# EasyEDA schematic EASYEDA.json
TITLE: Travichora (or whatever we're calling it now); REV: 2.0; Date: 2020-11-23; Sheet: 1/1; Drawn By: Liam
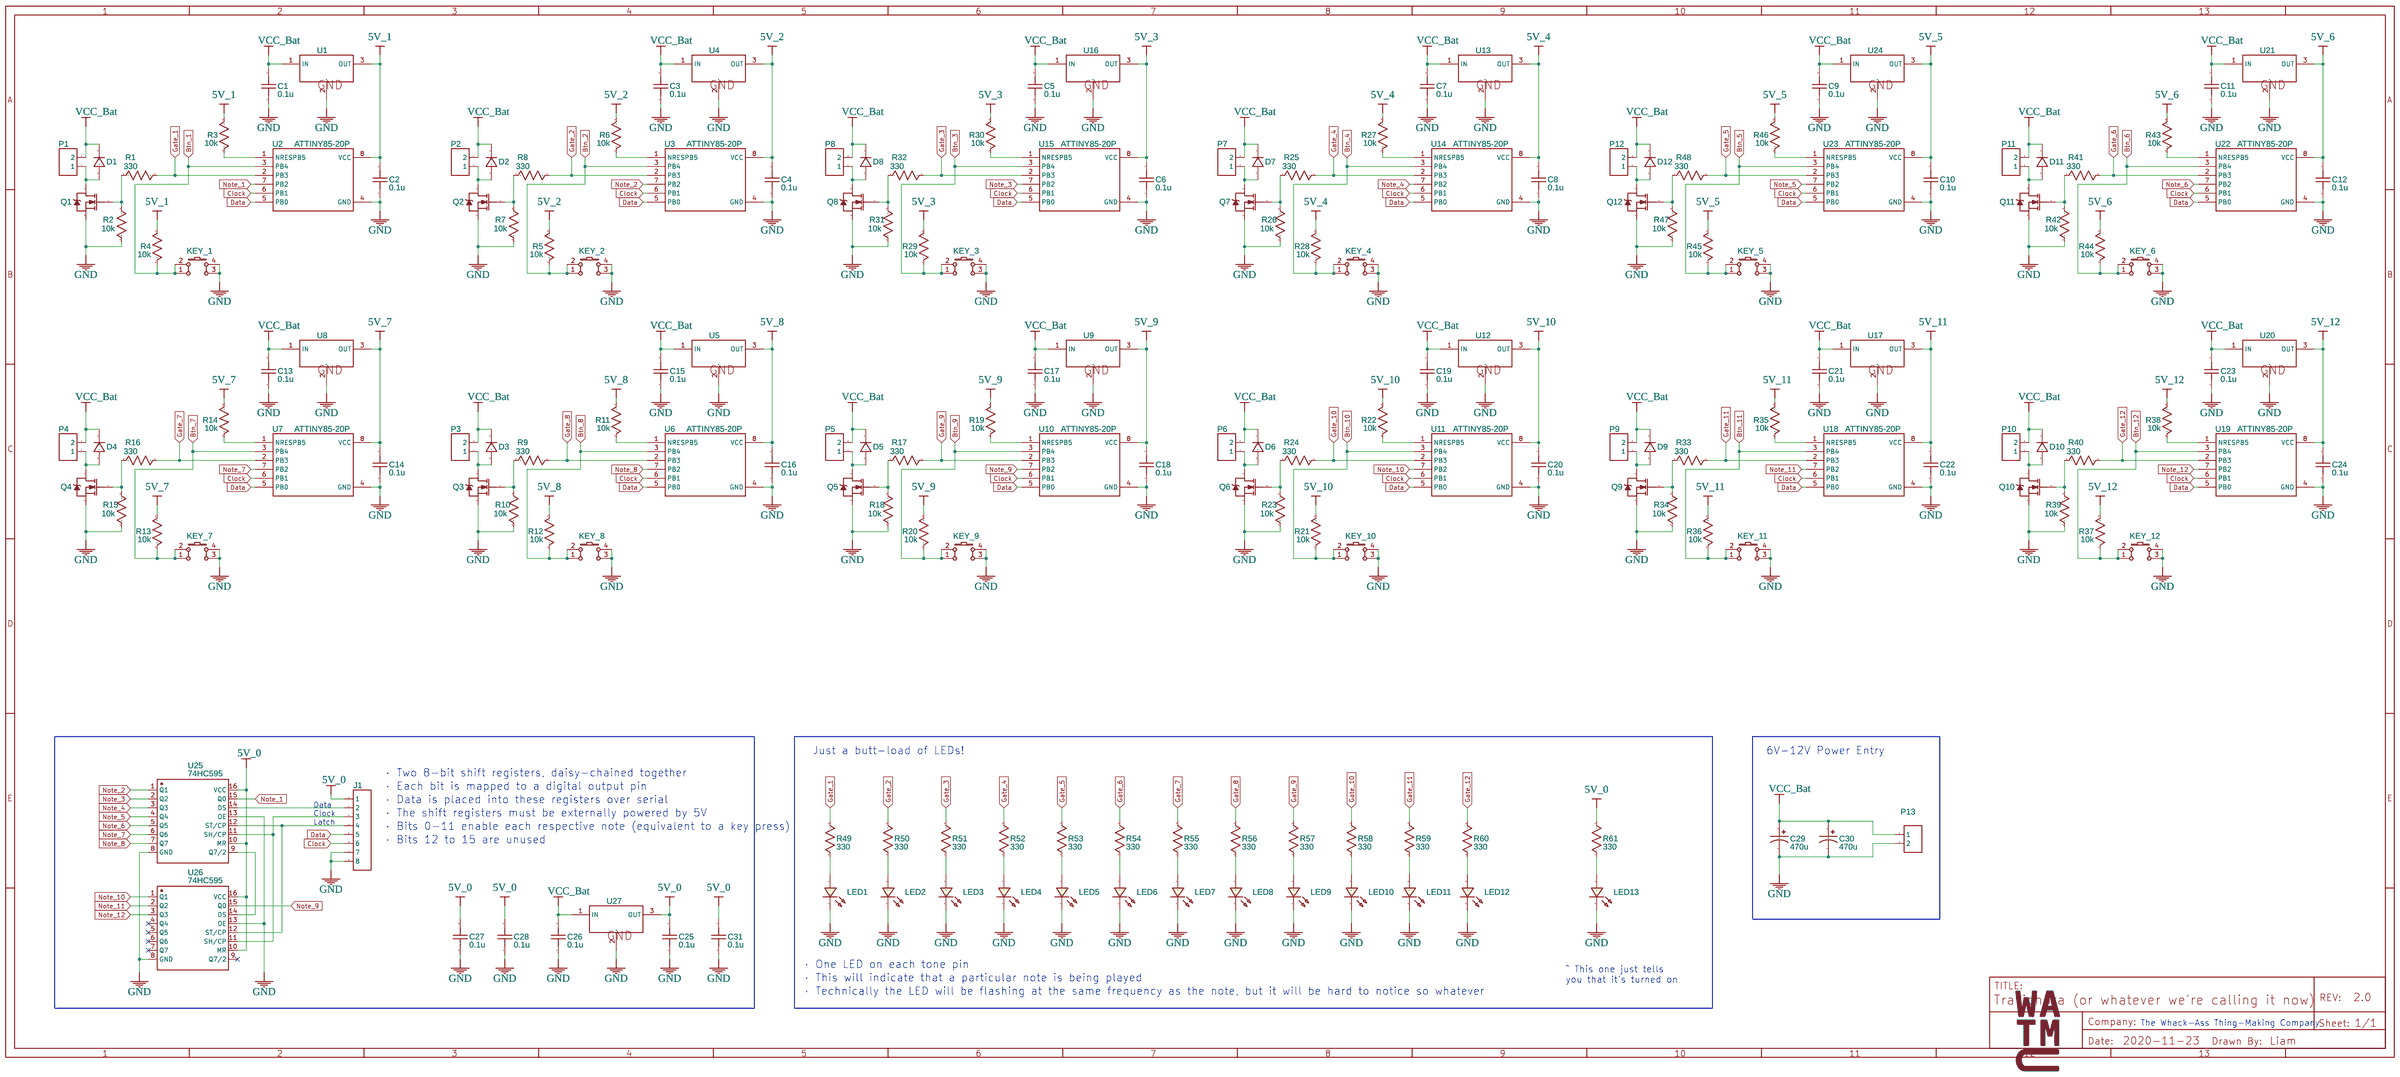
[diagram p0: schematic sheet]

## Parts
C1  0.1u  [C1206]
C2  0.1u  [C1206]
C3  0.1u  [C1206]
C4  0.1u  [C1206]
C5  0.1u  [C1206]
C6  0.1u  [C1206]
C7  0.1u  [C1206]
C8  0.1u  [C1206]
C9  0.1u  [C1206]
C10  0.1u  [C1206]
C11  0.1u  [C1206]
C12  0.1u  [C1206]
C13  0.1u  [C1206]
C14  0.1u  [C1206]
C15  0.1u  [C1206]
C16  0.1u  [C1206]
C17  0.1u  [C1206]
C18  0.1u  [C1206]
C19  0.1u  [C1206]
C20  0.1u  [C1206]
C21  0.1u  [C1206]
C22  0.1u  [C1206]
C23  0.1u  [C1206]
C24  0.1u  [C1206]
C25  0.1u  [C1206]
C26  0.1u  [C1206]
C27  0.1u  [C1206]
C28  0.1u  [C1206]
C29  470u  [CAP-D10.0×F5.0]
C30  470u  [CAP-D10.0×F5.0]
C31  0.1u  [C1206]
D1  1N4007  [DO-41_BD2.4-L4.7-P8.70-D0.9-RD]
D2  1N4007  [DO-41_BD2.4-L4.7-P8.70-D0.9-RD]
D3  1N4007  [DO-41_BD2.4-L4.7-P8.70-D0.9-RD]
D4  1N4007  [DO-41_BD2.4-L4.7-P8.70-D0.9-RD]
D5  1N4007  [DO-41_BD2.4-L4.7-P8.70-D0.9-RD]
D6  1N4007  [DO-41_BD2.4-L4.7-P8.70-D0.9-RD]
D7  1N4007  [DO-41_BD2.4-L4.7-P8.70-D0.9-RD]
D8  1N4007  [DO-41_BD2.4-L4.7-P8.70-D0.9-RD]
D9  1N4007  [DO-41_BD2.4-L4.7-P8.70-D0.9-RD]
D10  1N4007  [DO-41_BD2.4-L4.7-P8.70-D0.9-RD]
D11  1N4007  [DO-41_BD2.4-L4.7-P8.70-D0.9-RD]
D12  1N4007  [DO-41_BD2.4-L4.7-P8.70-D0.9-RD]
J1  HDR-M-2.54_1x8  [HDR-M-2.54_1X8]
KEY_1  K4-6×6_TH  [KEY-TH_4P-L6.0-W6.0-P4.50-LS6.5]
KEY_2  K4-6×6_TH  [KEY-TH_4P-L6.0-W6.0-P4.50-LS6.5]
KEY_3  K4-6×6_TH  [KEY-TH_4P-L6.0-W6.0-P4.50-LS6.5]
KEY_4  K4-6×6_TH  [KEY-TH_4P-L6.0-W6.0-P4.50-LS6.5]
KEY_5  K4-6×6_TH  [KEY-TH_4P-L6.0-W6.0-P4.50-LS6.5]
KEY_6  K4-6×6_TH  [KEY-TH_4P-L6.0-W6.0-P4.50-LS6.5]
KEY_7  K4-6×6_TH  [KEY-TH_4P-L6.0-W6.0-P4.50-LS6.5]
KEY_8  K4-6×6_TH  [KEY-TH_4P-L6.0-W6.0-P4.50-LS6.5]
KEY_9  K4-6×6_TH  [KEY-TH_4P-L6.0-W6.0-P4.50-LS6.5]
KEY_10  K4-6×6_TH  [KEY-TH_4P-L6.0-W6.0-P4.50-LS6.5]
KEY_11  K4-6×6_TH  [KEY-TH_4P-L6.0-W6.0-P4.50-LS6.5]
KEY_12  K4-6×6_TH  [KEY-TH_4P-L6.0-W6.0-P4.50-LS6.5]
LED1  LED-TH-3mm_R  [LED-TH_BD3.0_RED]
LED2  LED-TH-3mm_R  [LED-TH_BD3.0_RED]
LED3  LED-TH-3mm_R  [LED-TH_BD3.0_RED]
LED4  LED-TH-3mm_R  [LED-TH_BD3.0_RED]
LED5  LED-TH-3mm_R  [LED-TH_BD3.0_RED]
LED6  LED-TH-3mm_R  [LED-TH_BD3.0_RED]
LED7  LED-TH-3mm_R  [LED-TH_BD3.0_RED]
LED8  LED-TH-3mm_R  [LED-TH_BD3.0_RED]
LED9  LED-TH-3mm_R  [LED-TH_BD3.0_RED]
LED10  LED-TH-3mm_R  [LED-TH_BD3.0_RED]
LED11  LED-TH-3mm_R  [LED-TH_BD3.0_RED]
LED12  LED-TH-3mm_R  [LED-TH_BD3.0_RED]
LED13  LED-TH-3mm_G  [LED-TH_BD3.0_GREEN]
P1  Magnet 1  [CONN-TH_2P-P5.00]
P2  Magnet 1  [CONN-TH_2P-P5.00]
P3  Magnet 1  [CONN-TH_2P-P5.00]
P4  Magnet 1  [CONN-TH_2P-P5.00]
P5  Magnet 1  [CONN-TH_2P-P5.00]
P6  Magnet 1  [CONN-TH_2P-P5.00]
P7  Magnet 1  [CONN-TH_2P-P5.00]
P8  Magnet 1  [CONN-TH_2P-P5.00]
P9  Magnet 1  [CONN-TH_2P-P5.00]
P10  Magnet 1  [CONN-TH_2P-P5.00]
P11  Magnet 1  [CONN-TH_2P-P5.00]
P12  Magnet 1  [CONN-TH_2P-P5.00]
P13  Magnet 1  [CONN-TH_2P-P5.00]
Q1  30N06L-TA3-T  [TO-220-3_L10.0-W4.5-P2.54-T]
Q2  30N06L-TA3-T  [TO-220-3_L10.0-W4.5-P2.54-T]
Q3  30N06L-TA3-T  [TO-220-3_L10.0-W4.5-P2.54-T]
Q4  30N06L-TA3-T  [TO-220-3_L10.0-W4.5-P2.54-T]
Q5  30N06L-TA3-T  [TO-220-3_L10.0-W4.5-P2.54-T]
Q6  30N06L-TA3-T  [TO-220-3_L10.0-W4.5-P2.54-T]
Q7  30N06L-TA3-T  [TO-220-3_L10.0-W4.5-P2.54-T]
Q8  30N06L-TA3-T  [TO-220-3_L10.0-W4.5-P2.54-T]
Q9  30N06L-TA3-T  [TO-220-3_L10.0-W4.5-P2.54-T]
Q10  30N06L-TA3-T  [TO-220-3_L10.0-W4.5-P2.54-T]
Q11  30N06L-TA3-T  [TO-220-3_L10.0-W4.5-P2.54-T]
Q12  30N06L-TA3-T  [TO-220-3_L10.0-W4.5-P2.54-T]
R1  330  [R1206]
R2  10k  [R1206]
R3  10k  [R1206]
R4  10k  [R1206]
R5  10k  [R1206]
R6  10k  [R1206]
R7  10k  [R1206]
R8  330  [R1206]
R9  330  [R1206]
R10  10k  [R1206]
R11  10k  [R1206]
R12  10k  [R1206]
R13  10k  [R1206]
R14  10k  [R1206]
R15  10k  [R1206]
R16  330  [R1206]
R17  330  [R1206]
R18  10k  [R1206]
R19  10k  [R1206]
R20  10k  [R1206]
R21  10k  [R1206]
R22  10k  [R1206]
R23  10k  [R1206]
R24  330  [R1206]
R25  330  [R1206]
R26  10k  [R1206]
R27  10k  [R1206]
R28  10k  [R1206]
R29  10k  [R1206]
R30  10k  [R1206]
R31  10k  [R1206]
R32  330  [R1206]
R33  330  [R1206]
R34  10k  [R1206]
R35  10k  [R1206]
R36  10k  [R1206]
R37  10k  [R1206]
R38  10k  [R1206]
R39  10k  [R1206]
R40  330  [R1206]
R41  330  [R1206]
R42  10k  [R1206]
R43  10k  [R1206]
R44  10k  [R1206]
R45  10k  [R1206]
R46  10k  [R1206]
R47  10k  [R1206]
R48  330  [R1206]
R49  330  [R1206]
R50  330  [R1206]
R51  330  [R1206]
R52  330  [R1206]
R53  330  [R1206]
R54  330  [R1206]
R55  330  [R1206]
R56  330  [R1206]
R57  330  [R1206]
R58  330  [R1206]
R59  330  [R1206]
R60  330  [R1206]
R61  330  [R1206]
U1  7805(TO-220)  [TO-220-3_L10.0-W4.5-P2.54-L]
U2  ATTINY85-20P  [PDIP8]
U3  ATTINY85-20P  [PDIP8]
U4  7805(TO-220)  [TO-220-3_L10.0-W4.5-P2.54-L]
U5  7805(TO-220)  [TO-220-3_L10.0-W4.5-P2.54-L]
U6  ATTINY85-20P  [PDIP8]
U7  ATTINY85-20P  [PDIP8]
U8  7805(TO-220)  [TO-220-3_L10.0-W4.5-P2.54-L]
U9  7805(TO-220)  [TO-220-3_L10.0-W4.5-P2.54-L]
U10  ATTINY85-20P  [PDIP8]
U11  ATTINY85-20P  [PDIP8]
U12  7805(TO-220)  [TO-220-3_L10.0-W4.5-P2.54-L]
U13  7805(TO-220)  [TO-220-3_L10.0-W4.5-P2.54-L]
U14  ATTINY85-20P  [PDIP8]
U15  ATTINY85-20P  [PDIP8]
U16  7805(TO-220)  [TO-220-3_L10.0-W4.5-P2.54-L]
U17  7805(TO-220)  [TO-220-3_L10.0-W4.5-P2.54-L]
U18  ATTINY85-20P  [PDIP8]
U19  ATTINY85-20P  [PDIP8]
U20  7805(TO-220)  [TO-220-3_L10.0-W4.5-P2.54-L]
U21  7805(TO-220)  [TO-220-3_L10.0-W4.5-P2.54-L]
U22  ATTINY85-20P  [PDIP8]
U23  ATTINY85-20P  [PDIP8]
U24  7805(TO-220)  [TO-220-3_L10.0-W4.5-P2.54-L]
U25  74HC595  [DIP16]
U26  74HC595  [DIP16]
U27  7805(TO-220)  [TO-220-3_L10.0-W4.5-P2.54-L]

## Library data of the parts
C1-C28 C31 = C_1206_US: Contributor: LCEDA_Lib
C29 C30 = CE_TH_D10.0×F5.0_US: Contributor: LCEDA_Lib
D1-D12 = 1N4007: Supplier: LCSC; Manufacturer: SEMTECH; Supplier Part: C106903; Contributor: LCEDA_Lib
J1 = HDR-M-2.54_1x8: Supplier Part: C190820; Supplier: LCSC; Contributor: LCEDA_Lib
KEY_1-KEY_12 = K4-6×6_TH: Supplier: LCSC; Supplier Part: C136684; Manufacturer: 韩国韩荣; Manufacturer Part: K2-1102DP-E4SW-04; Contributor: LCEDA_Lib
LED1-LED12 = LED-TH-3mm_R: Manufacturer: EVERLIGHT(台湾亿光); Manufacturer Part: 204-10SDRD/S530-A3-L; Supplier Part: C84774; Supplier: LCSC; Contributor: LCEDA_Lib
LED13 = LED-TH-3mm_G: Manufacturer: EVERLIGHT(台湾亿光); Manufacturer Part: 204-10SYGD/S530-E3; Supplier Part: C85161; Contributor: LCEDA_Lib
P1-P13 = CONN-TH_2P-P5.00: Supplier: LCSC; Contributor: LCEDA_Lib
Q1-Q12 = 30N06L-TA3-T: Supplier: LCSC; Manufacturer: UTC; Supplier Part: C99961
R1-R61 = R_AXIAL-0.3_US: Contributor: LCEDA_Lib
U1 U4 U5 U8 U9 U12 U13 U16 U17 U20 U21 U24 U27 = 7805(TO-220): Supplier: LCSC; Manufacturer: STMicroelectronics; Manufacturer Part: L7805CV-DG; Supplier Part: C3795; Contributor: LCEDA_Lib
U2 U3 U6 U7 U10 U11 U14 U15 U18 U19 U22 U23 = ATTINY85-20P
U25 U26 = 74HC595N,112

## Nets
5V_0: C25.2 C27.2 C28.2 C31.2 J1.1 R61.2 U25.10(MR) U25.16(VCC) U26.10(MR) U26.16(VCC) U27.3(OUT)
5V_1: C2.2 R3.2 R4.2 U1.3(OUT) U2.8(VCC)
5V_2: C4.2 R5.2 R6.2 U3.8(VCC) U4.3(OUT)
5V_3: C6.2 R29.2 R30.2 U15.8(VCC) U16.3(OUT)
5V_4: C8.2 R27.2 R28.2 U13.3(OUT) U14.8(VCC)
5V_5: C10.2 R45.2 R46.2 U23.8(VCC) U24.3(OUT)
5V_6: C12.2 R43.2 R44.2 U21.3(OUT) U22.8(VCC)
5V_7: C14.2 R13.2 R14.2 U7.8(VCC) U8.3(OUT)
5V_8: C16.2 R11.2 R12.2 U5.3(OUT) U6.8(VCC)
5V_9: C18.2 R19.2 R20.2 U9.3(OUT) U10.8(VCC)
5V_10: C20.2 R21.2 R22.2 U11.8(VCC) U12.3(OUT)
5V_11: C22.2 R35.2 R36.2 U17.3(OUT) U18.8(VCC)
5V_12: C24.2 R37.2 R38.2 U19.8(VCC) U20.3(OUT)
GND: C1.1 C2.1 C3.1 C4.1 C5.1 C6.1 C7.1 C8.1 C9.1 C10.1 C11.1 C12.1 C13.1 C14.1 C15.1 C16.1 C17.1 C18.1 C19.1 C20.1 C21.1 C22.1 C23.1 C24.1 C25.1 C26.1 C27.1 C28.1 C29.2 C30.2 C31.1 J1.7 J1.8 KEY_1.3 KEY_1.4 KEY_2.3 KEY_2.4 KEY_3.3 KEY_3.4 KEY_4.3 KEY_4.4 KEY_5.3 KEY_5.4 KEY_6.3 KEY_6.4 KEY_7.3 KEY_7.4 KEY_8.3 KEY_8.4 KEY_9.3 KEY_9.4 KEY_10.3 KEY_10.4 KEY_11.3 KEY_11.4 KEY_12.3 KEY_12.4 LED1.2 LED2.2 LED3.2 LED4.2 LED5.2 LED6.2 LED7.2 LED8.2 LED9.2 LED10.2 LED11.2 LED12.2 LED13.2 P13.2 Q1.3(S) Q2.3(S) Q3.3(S) Q4.3(S) Q5.3(S) Q6.3(S) Q7.3(S) Q8.3(S) Q9.3(S) Q10.3(S) Q11.3(S) Q12.3(S) R2.1 R7.1 R10.1 R15.1 R18.1 R23.1 R26.1 R31.1 R34.1 R39.1 R42.1 R47.1 U1.2(GND) U2.4(GND) U3.4(GND) U4.2(GND) U5.2(GND) U6.4(GND) U7.4(GND) U8.2(GND) U9.2(GND) U10.4(GND) U11.4(GND) U12.2(GND) U13.2(GND) U14.4(GND) U15.4(GND) U16.2(GND) U17.2(GND) U18.4(GND) U19.4(GND) U20.2(GND) U21.2(GND) U22.4(GND) U23.4(GND) U24.2(GND) U25.8(GND) U25.13(OE) U26.8(GND) U26.13(OE) U27.2(GND)
VCC_Bat: C1.2 C3.2 C5.2 C7.2 C9.2 C11.2 C13.2 C15.2 C17.2 C19.2 C21.2 C23.2 C26.2 C29.1 C30.1 D1.1 D2.1 D3.1 D4.1 D5.1 D6.1 D7.1 D8.1 D9.1 D10.1 D11.1 D12.1 P1.2 P2.2 P3.2 P4.2 P5.2 P6.2 P7.2 P8.2 P9.2 P10.2 P11.2 P12.2 P13.1 U1.1(IN) U4.1(IN) U5.1(IN) U8.1(IN) U9.1(IN) U12.1(IN) U13.1(IN) U16.1(IN) U17.1(IN) U20.1(IN) U21.1(IN) U24.1(IN) U27.1(IN)
Btn_1: KEY_1.1 KEY_1.2 R4.1 U2.3(PB4)
Btn_2: KEY_2.1 KEY_2.2 R5.1 U3.3(PB4)
Btn_3: KEY_3.1 KEY_3.2 R29.1 U15.3(PB4)
Btn_4: KEY_4.1 KEY_4.2 R28.1 U14.3(PB4)
Btn_5: KEY_5.1 KEY_5.2 R45.1 U23.3(PB4)
Btn_6: KEY_6.1 KEY_6.2 R44.1 U22.3(PB4)
Btn_7: KEY_7.1 KEY_7.2 R13.1 U7.3(PB4)
Btn_8: KEY_8.1 KEY_8.2 R12.1 U6.3(PB4)
Btn_9: KEY_9.1 KEY_9.2 R20.1 U10.3(PB4)
Btn_10: KEY_10.1 KEY_10.2 R21.1 U11.3(PB4)
Btn_11: KEY_11.1 KEY_11.2 R36.1 U18.3(PB4)
Btn_12: KEY_12.1 KEY_12.2 R37.1 U19.3(PB4)
Clock: J1.6 U2.6(PB1) U3.6(PB1) U6.6(PB1) U7.6(PB1) U10.6(PB1) U11.6(PB1) U14.6(PB1) U15.6(PB1) U18.6(PB1) U19.6(PB1) U22.6(PB1) U23.6(PB1)
Data: J1.5 U2.5(PB0) U3.5(PB0) U6.5(PB0) U7.5(PB0) U10.5(PB0) U11.5(PB0) U14.5(PB0) U15.5(PB0) U18.5(PB0) U19.5(PB0) U22.5(PB0) U23.5(PB0)
Gate_1: R1.2 R49.2 U2.2(PB3)
Gate_2: R8.2 R50.2 U3.2(PB3)
Gate_3: R32.2 R51.2 U15.2(PB3)
Gate_4: R25.2 R52.2 U14.2(PB3)
Gate_5: R48.2 R53.2 U23.2(PB3)
Gate_6: R41.2 R54.2 U22.2(PB3)
Gate_7: R16.2 R55.2 U7.2(PB3)
Gate_8: R9.2 R56.2 U6.2(PB3)
Gate_9: R17.2 R57.2 U10.2(PB3)
Gate_10: R24.2 R58.2 U11.2(PB3)
Gate_11: R33.2 R59.2 U18.2(PB3)
Gate_12: R40.2 R60.2 U19.2(PB3)
Note_1: U2.7(PB2) U25.15(Q0)
Note_2: U3.7(PB2) U25.1(Q1)
Note_3: U15.7(PB2) U25.2(Q2)
Note_4: U14.7(PB2) U25.3(Q3)
Note_5: U23.7(PB2) U25.4(Q4)
Note_6: U22.7(PB2) U25.5(Q5)
Note_7: U7.7(PB2) U25.6(Q6)
Note_8: U6.7(PB2) U25.7(Q7)
Note_9: U10.7(PB2) U26.15(Q0)
Note_10: U11.7(PB2) U26.1(Q1)
Note_11: U18.7(PB2) U26.2(Q2)
Note_12: U19.7(PB2) U26.3(Q3)
Net-(D1-2): D1.2 P1.1 Q1.2(D)
Net-(D2-2): D2.2 P2.1 Q2.2(D)
Net-(D3-2): D3.2 P3.1 Q3.2(D)
Net-(D4-2): D4.2 P4.1 Q4.2(D)
Net-(D5-2): D5.2 P5.1 Q5.2(D)
Net-(D6-2): D6.2 P6.1 Q6.2(D)
Net-(D7-2): D7.2 P7.1 Q7.2(D)
Net-(D8-2): D8.2 P8.1 Q8.2(D)
Net-(D9-2): D9.2 P9.1 Q9.2(D)
Net-(D10-2): D10.2 P10.1 Q10.2(D)
Net-(D11-2): D11.2 P11.1 Q11.2(D)
Net-(D12-2): D12.2 P12.1 Q12.2(D)
Net-(J1-2): J1.2 U25.14(DS)
Net-(J1-3): J1.3 U25.11(SH/CP) U26.11(SH/CP)
Net-(J1-4): J1.4 U25.12(ST/CP) U26.12(ST/CP)
Net-(LED1-1): LED1.1 R49.1
Net-(LED2-1): LED2.1 R50.1
Net-(LED3-1): LED3.1 R51.1
Net-(LED4-1): LED4.1 R52.1
Net-(LED5-1): LED5.1 R53.1
Net-(LED6-1): LED6.1 R54.1
Net-(LED7-1): LED7.1 R55.1
Net-(LED8-1): LED8.1 R56.1
Net-(LED9-1): LED9.1 R57.1
Net-(LED10-1): LED10.1 R58.1
Net-(LED11-1): LED11.1 R59.1
Net-(LED12-1): LED12.1 R60.1
Net-(LED13-1): LED13.1 R61.1
Net-(Q1-1): Q1.1(G) R1.1 R2.2
Net-(Q2-1): Q2.1(G) R7.2 R8.1
Net-(Q3-1): Q3.1(G) R9.1 R10.2
Net-(Q4-1): Q4.1(G) R15.2 R16.1
Net-(Q5-1): Q5.1(G) R17.1 R18.2
Net-(Q6-1): Q6.1(G) R23.2 R24.1
Net-(Q7-1): Q7.1(G) R25.1 R26.2
Net-(Q8-1): Q8.1(G) R31.2 R32.1
Net-(Q9-1): Q9.1(G) R33.1 R34.2
Net-(Q10-1): Q10.1(G) R39.2 R40.1
Net-(Q11-1): Q11.1(G) R41.1 R42.2
Net-(Q12-1): Q12.1(G) R47.2 R48.1
Net-(R3-1): R3.1 U2.1(NRESPB5)
Net-(R6-1): R6.1 U3.1(NRESPB5)
Net-(R11-1): R11.1 U6.1(NRESPB5)
Net-(R14-1): R14.1 U7.1(NRESPB5)
Net-(R19-1): R19.1 U10.1(NRESPB5)
Net-(R22-1): R22.1 U11.1(NRESPB5)
Net-(R27-1): R27.1 U14.1(NRESPB5)
Net-(R30-1): R30.1 U15.1(NRESPB5)
Net-(R35-1): R35.1 U18.1(NRESPB5)
Net-(R38-1): R38.1 U19.1(NRESPB5)
Net-(R43-1): R43.1 U22.1(NRESPB5)
Net-(R46-1): R46.1 U23.1(NRESPB5)
Net-(U25-9): U25.9(Q7/2) U26.14(DS)

Not connected (* = marked no-connect by the designer): U26 4(Q4)* 5(Q5)* 6(Q6)* 7(Q7)* 9(Q7/2)*

## Notes on the sheet
- Just a butt-load of LEDs!
- 6V-12V Power Entry
- ⋅ Two 8-bit shift registers, daisy-chained together
- ⋅ Each bit is mapped to a digital output pin
- ⋅ Data is placed into these registers over serial
- Data
  Clock
  Latch
- ⋅ The shift registers must be externally powered by 5V
- ⋅ Bits 0-11 enable each respective note (equivalent to a key press)
- ⋅ Bits 12 to 15 are unused
- ⋅ One LED on each tone pin
- ^ This one just tells
  you that it's turned on
- ⋅ This will indicate that a particular note is being played
- ⋅ Technically the LED will be flashing at the same frequency as the note, but it will be hard to notice so whatever
- The Whack-Ass Thing-Making Company
